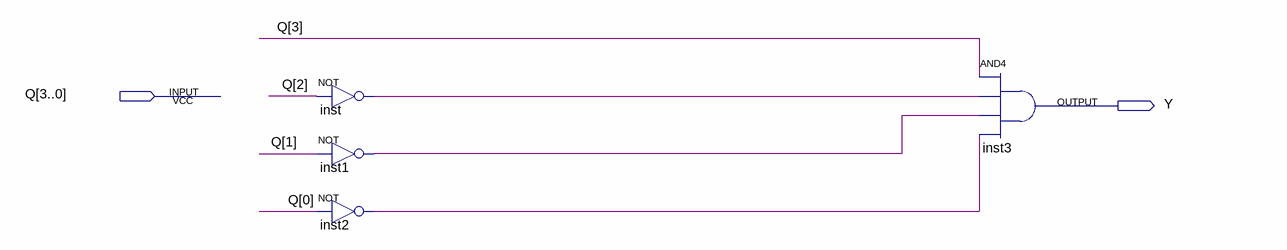
[diagram p0: schematic sheet]
// Quartus schematic OUTPUT_Y.bdf as structural Verilog: 4 symbols, 2 pins
module OUTPUT_Y (
  input  [3:0] Q,
  output Y
);

  wire inst1_out, inst2_out, inst_out;

  not inst (inst_out, Q[2]);
  not inst1 (inst1_out, Q[1]);
  not inst2 (inst2_out, Q[0]);
  and inst3 (Y, Q[3], inst_out, inst1_out, inst2_out);
endmodule
